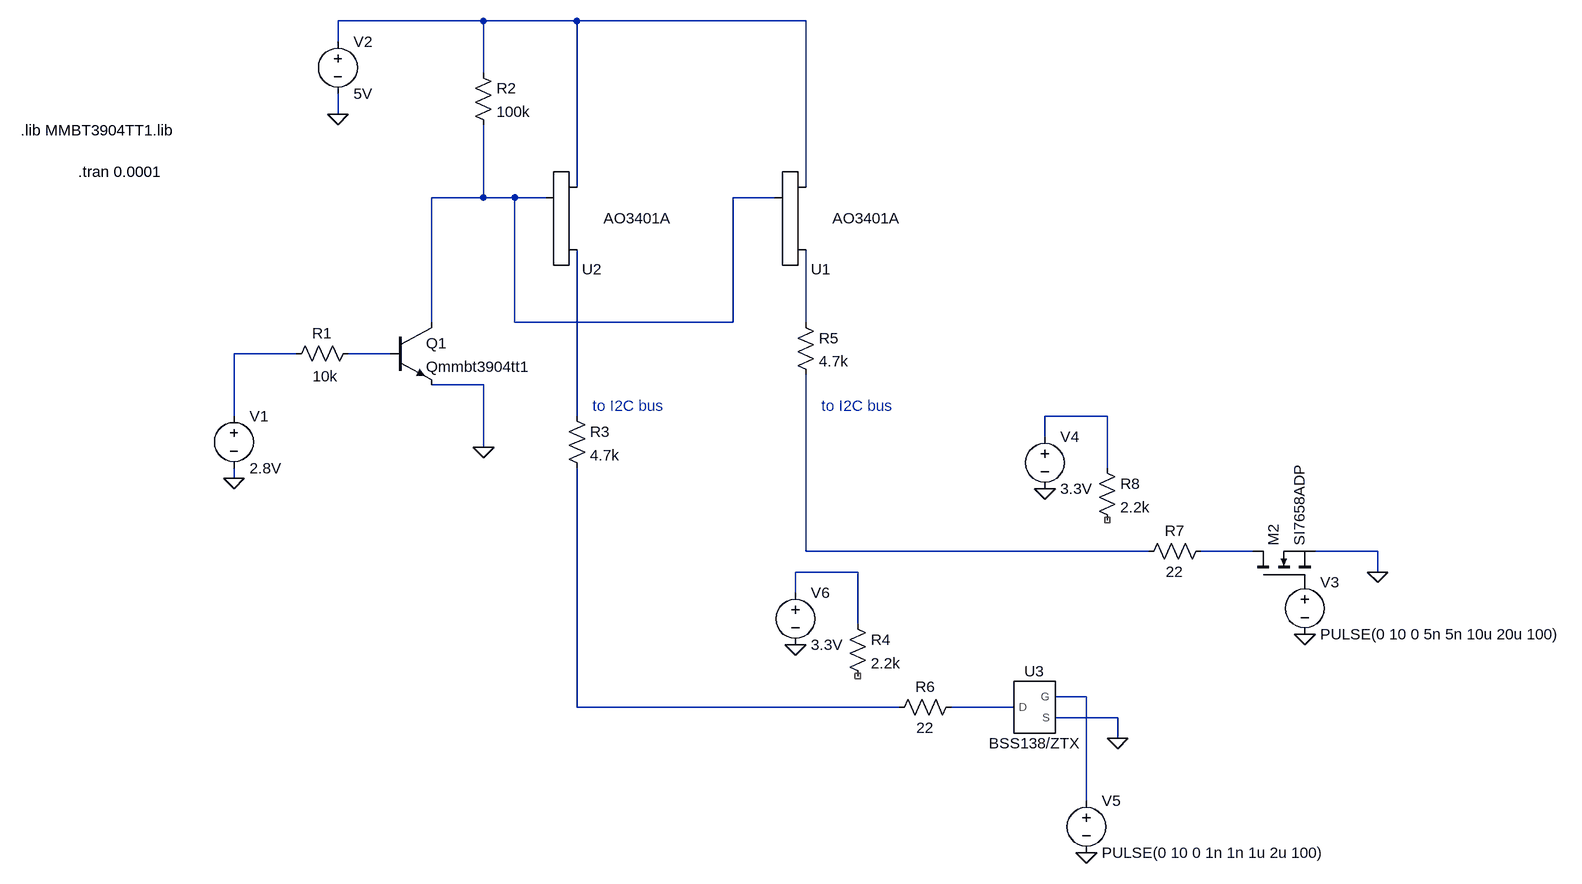
[diagram p0: schematic I2C_External.asc]
I2C_External.asc, the LTspice schematic file:
Version 4
SHEET 1 2076 1092
WIRE 384 -304 160 -304
WIRE 528 -304 384 -304
WIRE 880 -304 528 -304
WIRE 160 -272 160 -304
WIRE 384 -224 384 -304
WIRE 160 -160 160 -192
WIRE 528 -48 528 -304
WIRE 880 -48 880 -304
WIRE 384 -32 384 -144
WIRE 384 -32 304 -32
WIRE 432 -32 384 -32
WIRE 480 -32 432 -32
WIRE 832 -32 768 -32
WIRE 304 160 304 -32
WIRE 432 160 432 -32
WIRE 768 160 768 -32
WIRE 768 160 432 160
WIRE 880 160 880 48
WIRE 96 208 0 208
WIRE 240 208 176 208
WIRE 384 256 304 256
WIRE 0 304 0 208
WIRE 528 304 528 48
WIRE 1344 304 1248 304
WIRE 1248 336 1248 304
WIRE 384 352 384 256
WIRE 1344 384 1344 304
WIRE 0 400 0 384
WIRE 880 512 880 240
WIRE 1408 512 880 512
WIRE 1568 512 1488 512
WIRE 1760 512 1664 512
WIRE 960 544 864 544
WIRE 1760 544 1760 512
WIRE 864 576 864 544
WIRE 960 624 960 544
WIRE 1312 736 1264 736
WIRE 528 752 528 384
WIRE 1024 752 528 752
WIRE 1200 752 1104 752
WIRE 1360 768 1264 768
WIRE 1360 800 1360 768
WIRE 1312 896 1312 736
FLAG 0 400 0
FLAG 160 -160 0
FLAG 384 352 0
FLAG 1760 544 0
FLAG 1648 640 0
FLAG 1248 416 0
FLAG 1360 800 0
FLAG 1312 976 0
FLAG 864 656 0
SYMBOL voltage 0 288 R0
WINDOW 123 0 0 Left 0
WINDOW 39 0 0 Left 0
SYMATTR InstName V1
SYMATTR Value 2.8V
SYMBOL res 192 192 R90
WINDOW 0 0 56 VBottom 2
WINDOW 3 35 51 VTop 2
SYMATTR InstName R1
SYMATTR Value 10k
SYMBOL res 368 -240 R0
SYMATTR InstName R2
SYMATTR Value 100k
SYMBOL voltage 160 -288 R0
WINDOW 123 0 0 Left 0
WINDOW 39 0 0 Left 0
SYMATTR InstName V2
SYMATTR Value 5V
SYMBOL res 512 288 R0
SYMATTR InstName R3
SYMATTR Value 4.7k
SYMBOL AO3401A 560 16 M180
WINDOW 3 61 1 Top 2
SYMATTR InstName U2
SYMBOL npn 240 160 R0
SYMATTR InstName Q1
SYMATTR Value Qmmbt3904tt1
SYMBOL res 864 144 R0
SYMATTR InstName R5
SYMATTR Value 4.7k
SYMBOL AO3401A 912 16 M180
WINDOW 3 61 1 Top 2
SYMATTR InstName U1
SYMBOL res 1328 368 R0
SYMATTR InstName R8
SYMATTR Value 2.2k
SYMBOL voltage 1248 320 R0
SYMATTR InstName V4
SYMATTR Value 3.3V
SYMBOL voltage 1312 880 R0
WINDOW 123 0 0 Left 0
WINDOW 39 0 0 Left 0
SYMATTR InstName V5
SYMATTR Value PULSE(0 10 0 1n 1n 1u 2u 100)
SYMBOL res 944 608 R0
SYMATTR InstName R4
SYMATTR Value 2.2k
SYMBOL voltage 864 560 R0
SYMATTR InstName V6
SYMATTR Value 3.3V
SYMBOL voltage 1648 544 R0
WINDOW 123 0 0 Left 0
WINDOW 39 0 0 Left 0
SYMATTR InstName V3
SYMATTR Value PULSE(0 10 0 5n 5n 10u 20u 100)
SYMBOL nmos 1568 560 R270
SYMATTR InstName M2
SYMATTR Value SI7658ADP
SYMBOL res 1120 736 R90
WINDOW 0 0 56 VBottom 2
WINDOW 3 32 56 VTop 2
SYMATTR InstName R6
SYMATTR Value 22
SYMBOL res 1504 496 R90
WINDOW 0 0 56 VBottom 2
WINDOW 3 32 56 VTop 2
SYMATTR InstName R7
SYMATTR Value 22
SYMBOL BSS138_ZTX 1232 752 R0
SYMATTR InstName U3
TEXT 552 288 Left 2 ;to I2C bus
TEXT -240 -72 Left 2 !.tran 0.0001
TEXT -328 -136 Left 2 !.lib MMBT3904TT1.lib
TEXT 904 288 Left 2 ;to I2C bus

The netlist it stands for:
* I2C_External.asc
V1 N004 0 2.8V
R1 N005 N004 10k
R2 N001 N002 100k
V2 N001 0 5V
R3 N006 N012 4.7k
XU2 N006 N002 N001 AO3401A
Q1 N002 N005 0 0 Qmmbt3904tt1
R5 N003 N008 4.7k
XU1 N003 N002 N001 AO3401A
R8 N007 NC_01 2.2k
V4 N007 0 3.3V
V5 N011 0 PULSE(0 10 0 1n 1n 1u 2u 100)
R4 N010 NC_02 2.2k
V6 N010 0 3.3V
V3 P001 0 PULSE(0 10 0 5n 5n 10u 20u 100)
M2 N009 P001 0 0 SI7658ADP
R6 N013 N012 22
R7 N009 N008 22
XU3 N013 N011 0 BSS138/ZTX  ; pins D G S
.model NPN NPN
.model PNP PNP
.lib standard.bjt
.model NMOS NMOS
.model PMOS PMOS
.lib standard.mos
* to I2C bus
.tran 0.0001
.lib MMBT3904TT1.lib
* to I2C bus
.lib AO3401A.mod
.lib BSS138.lib
.backanno
.end